# EAGLE schematic Magic Panel I2C Interface (EAGLE 6.5.0)
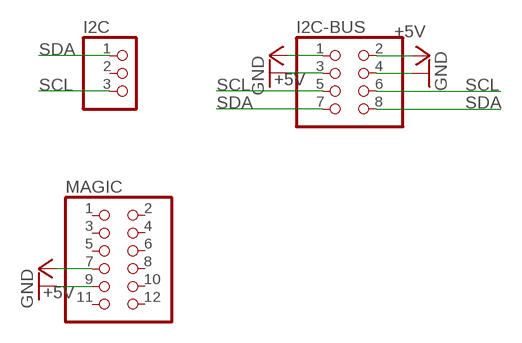
[diagram p0: schematic, sheet 1]

## Parts
I2C  PINHD-1X3CB  [1X03-CLEANBIG]
I2C-BUS  PINHD-2X4  [2X04]
MAGIC  PINHD-2X6  [2X06]

## Nets
+5V: I2C-BUS.1 I2C-BUS.2 MAGIC.7
GND: I2C-BUS.3 I2C-BUS.4 MAGIC.9
SCL: I2C-BUS.5 I2C-BUS.6 I2C.3
SDA: I2C-BUS.7 I2C-BUS.8 I2C.1
Unconnected: I2C.2 MAGIC.1 MAGIC.2 MAGIC.3 MAGIC.4 MAGIC.5 MAGIC.6 MAGIC.8 MAGIC.10 MAGIC.11 MAGIC.12

## Library data of the parts
I2C = adafruit:PINHD-1X3: PIN HEADER
I2C-BUS = adafruit:PINHD-2X4: PIN HEADER
MAGIC = pinhead:PINHD-2X6: PIN HEADER